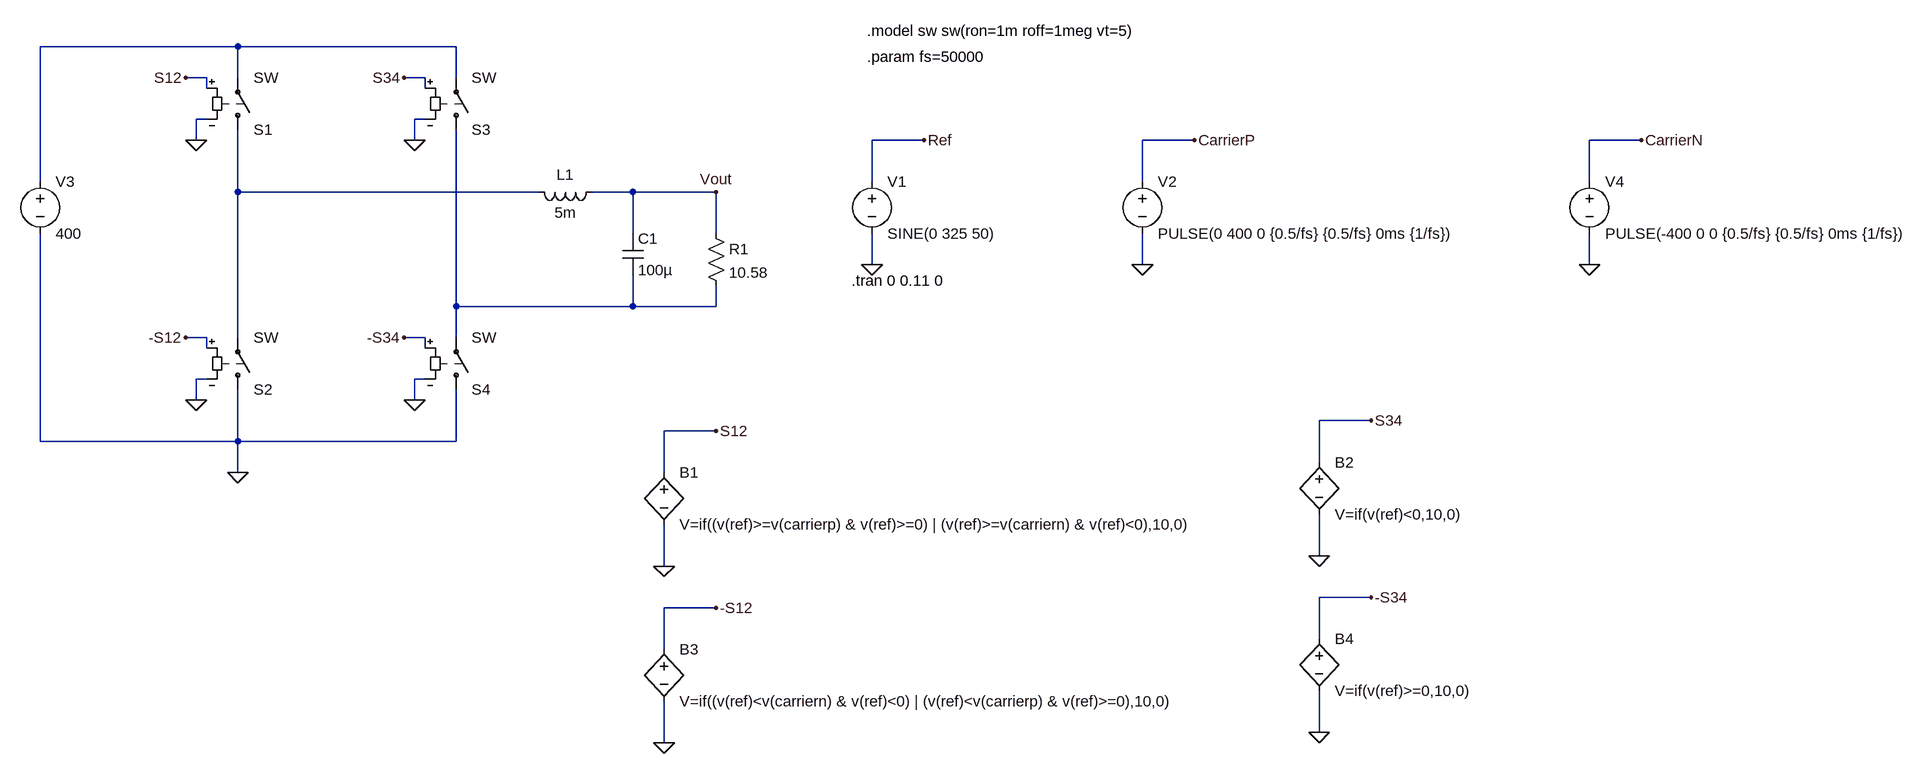
[diagram p0: schematic FullBridge_ModifiedUnipolarModulation.asc]
FullBridge_ModifiedUnipolarModulation.asc, the LTspice schematic file:
Version 4
SHEET 1 1912 740
WIRE -768 -368 -1072 -368
WIRE -432 -368 -768 -368
WIRE -816 -320 -848 -320
WIRE -768 -320 -768 -368
WIRE -480 -320 -512 -320
WIRE -432 -320 -432 -368
WIRE -816 -304 -816 -320
WIRE -480 -304 -480 -320
WIRE -816 -256 -832 -256
WIRE -480 -256 -496 -256
WIRE -832 -224 -832 -256
WIRE -496 -224 -496 -256
WIRE 288 -224 208 -224
WIRE 704 -224 624 -224
WIRE 1392 -224 1312 -224
WIRE -1072 -160 -1072 -368
WIRE 208 -160 208 -224
WIRE 624 -160 624 -224
WIRE 1312 -160 1312 -224
WIRE -768 -144 -768 -240
WIRE -304 -144 -768 -144
WIRE -160 -144 -224 -144
WIRE -32 -144 -160 -144
WIRE -160 -80 -160 -144
WIRE -32 -80 -32 -144
WIRE 208 -32 208 -80
WIRE 624 -32 624 -80
WIRE 1312 -32 1312 -80
WIRE -432 32 -432 -240
WIRE -160 32 -160 -16
WIRE -160 32 -432 32
WIRE -32 32 -32 0
WIRE -32 32 -160 32
WIRE -816 80 -848 80
WIRE -768 80 -768 -144
WIRE -480 80 -512 80
WIRE -432 80 -432 32
WIRE -816 96 -816 80
WIRE -480 96 -480 80
WIRE -816 144 -832 144
WIRE -480 144 -496 144
WIRE -832 176 -832 144
WIRE -496 176 -496 144
WIRE 976 208 896 208
WIRE -32 224 -112 224
WIRE -1072 240 -1072 -80
WIRE -768 240 -768 160
WIRE -768 240 -1072 240
WIRE -432 240 -432 160
WIRE -432 240 -768 240
WIRE 896 272 896 208
WIRE -768 288 -768 240
WIRE -112 288 -112 224
WIRE 896 416 896 352
WIRE -112 432 -112 368
WIRE 976 480 896 480
WIRE -32 496 -112 496
WIRE 896 544 896 480
WIRE -112 560 -112 496
WIRE 896 688 896 624
WIRE -112 704 -112 640
FLAG 208 -32 0
FLAG 288 -224 Ref
FLAG 624 -32 0
FLAG 704 -224 CarrierP
FLAG 896 416 0
FLAG -112 432 0
FLAG -32 224 S12
FLAG 976 208 S34
FLAG -832 -224 0
FLAG -496 176 0
FLAG -832 176 0
FLAG -496 -224 0
FLAG -848 -320 S12
FLAG -512 80 -S34
FLAG -848 80 -S12
FLAG -512 -320 S34
FLAG -768 288 0
FLAG -32 -144 Vout
FLAG 896 688 0
FLAG -112 704 0
FLAG -32 496 -S12
FLAG 976 480 -S34
FLAG 1312 -32 0
FLAG 1392 -224 CarrierN
SYMBOL voltage 208 -176 R0
WINDOW 123 0 0 Left 0
WINDOW 39 0 0 Left 0
SYMATTR InstName V1
SYMATTR Value SINE(0 325 50)
SYMBOL voltage 624 -176 R0
WINDOW 123 0 0 Left 0
WINDOW 39 0 0 Left 0
SYMATTR InstName V2
SYMATTR Value PULSE(0 400 0 {0.5/fs} {0.5/fs} 0ms {1/fs})
SYMBOL bv -112 272 R0
SYMATTR InstName B1
SYMATTR Value V=if((v(ref)>=v(carrierp) & v(ref)>=0) | (v(ref)>=v(carriern) & v(ref)<0),10,0)
SYMBOL bv 896 256 R0
SYMATTR InstName B2
SYMATTR Value V=if(v(ref)<0,10,0)
SYMBOL sw -768 -224 M180
SYMATTR InstName S1
SYMBOL sw -768 176 M180
SYMATTR InstName S2
SYMBOL sw -432 -224 M180
SYMATTR InstName S3
SYMBOL sw -432 176 M180
SYMATTR InstName S4
SYMBOL ind -208 -160 R90
WINDOW 0 5 56 VBottom 2
WINDOW 3 32 56 VTop 2
SYMATTR InstName L1
SYMATTR Value 5m
SYMATTR SpiceLine Rser=100m
SYMBOL res -48 -96 R0
SYMATTR InstName R1
SYMATTR Value 10.58
SYMBOL voltage -1072 -176 R0
WINDOW 123 0 0 Left 0
WINDOW 39 0 0 Left 0
SYMATTR InstName V3
SYMATTR Value 400
SYMBOL cap -176 -80 R0
SYMATTR InstName C1
SYMATTR Value 100µ
SYMATTR SpiceLine Rser=75m
SYMBOL bv -112 544 R0
SYMATTR InstName B3
SYMATTR Value V=if((v(ref)<v(carriern) & v(ref)<0) | (v(ref)<v(carrierp) & v(ref)>=0),10,0)
SYMBOL bv 896 528 R0
SYMATTR InstName B4
SYMATTR Value V=if(v(ref)>=0,10,0)
SYMBOL voltage 1312 -176 R0
WINDOW 123 0 0 Left 0
WINDOW 39 0 0 Left 0
SYMATTR InstName V4
SYMATTR Value PULSE(-400 0 0 {0.5/fs} {0.5/fs} 0ms {1/fs})
TEXT 176 -8 Left 2 !.tran 0 0.11 0
TEXT 200 -352 Left 2 !.param fs=50000
TEXT 200 -392 Left 2 !.model sw sw(ron=1m roff=1meg vt=5)

The netlist it stands for:
* FullBridge_ModifiedUnipolarModulation.asc
V1 Ref 0 SINE(0 325 50)
V2 CarrierP 0 PULSE(0 400 0 {0.5/fs} {0.5/fs} 0ms {1/fs})
B1 S12 0 V=if((v(ref)>=v(carrierp) & v(ref)>=0) | (v(ref)>=v(carriern) & v(ref)<0),10,0)
B2 S34 0 V=if(v(ref)<0,10,0)
S1 N002 N001 S12 0 SW
S2 0 N002 -S12 0 SW
S3 N003 N001 S34 0 SW
S4 0 N003 -S34 0 SW
L1 Vout N002 5m Rser=100m
R1 Vout N003 10.58
V3 N001 0 400
C1 Vout N003 100µ Rser=75m
B3 -S12 0 V=if((v(ref)<v(carriern) & v(ref)<0) | (v(ref)<v(carrierp) & v(ref)>=0),10,0)
B4 -S34 0 V=if(v(ref)>=0,10,0)
V4 CarrierN 0 PULSE(-400 0 0 {0.5/fs} {0.5/fs} 0ms {1/fs})
.tran 0 0.11 0
.param fs=50000
.model sw sw(ron=1m roff=1meg vt=5)
.backanno
.end